# Altium schematic sheet Driver_Modulation.SchDoc: Modulation Driver
size A4; Author: Peter Tanner; SheetNumber: 3; SheetTotal: 9; SPICEModelCacheFEZYSCPS: <root> / <DocumentId>FEZYSCPS</DocumentId> / </root>
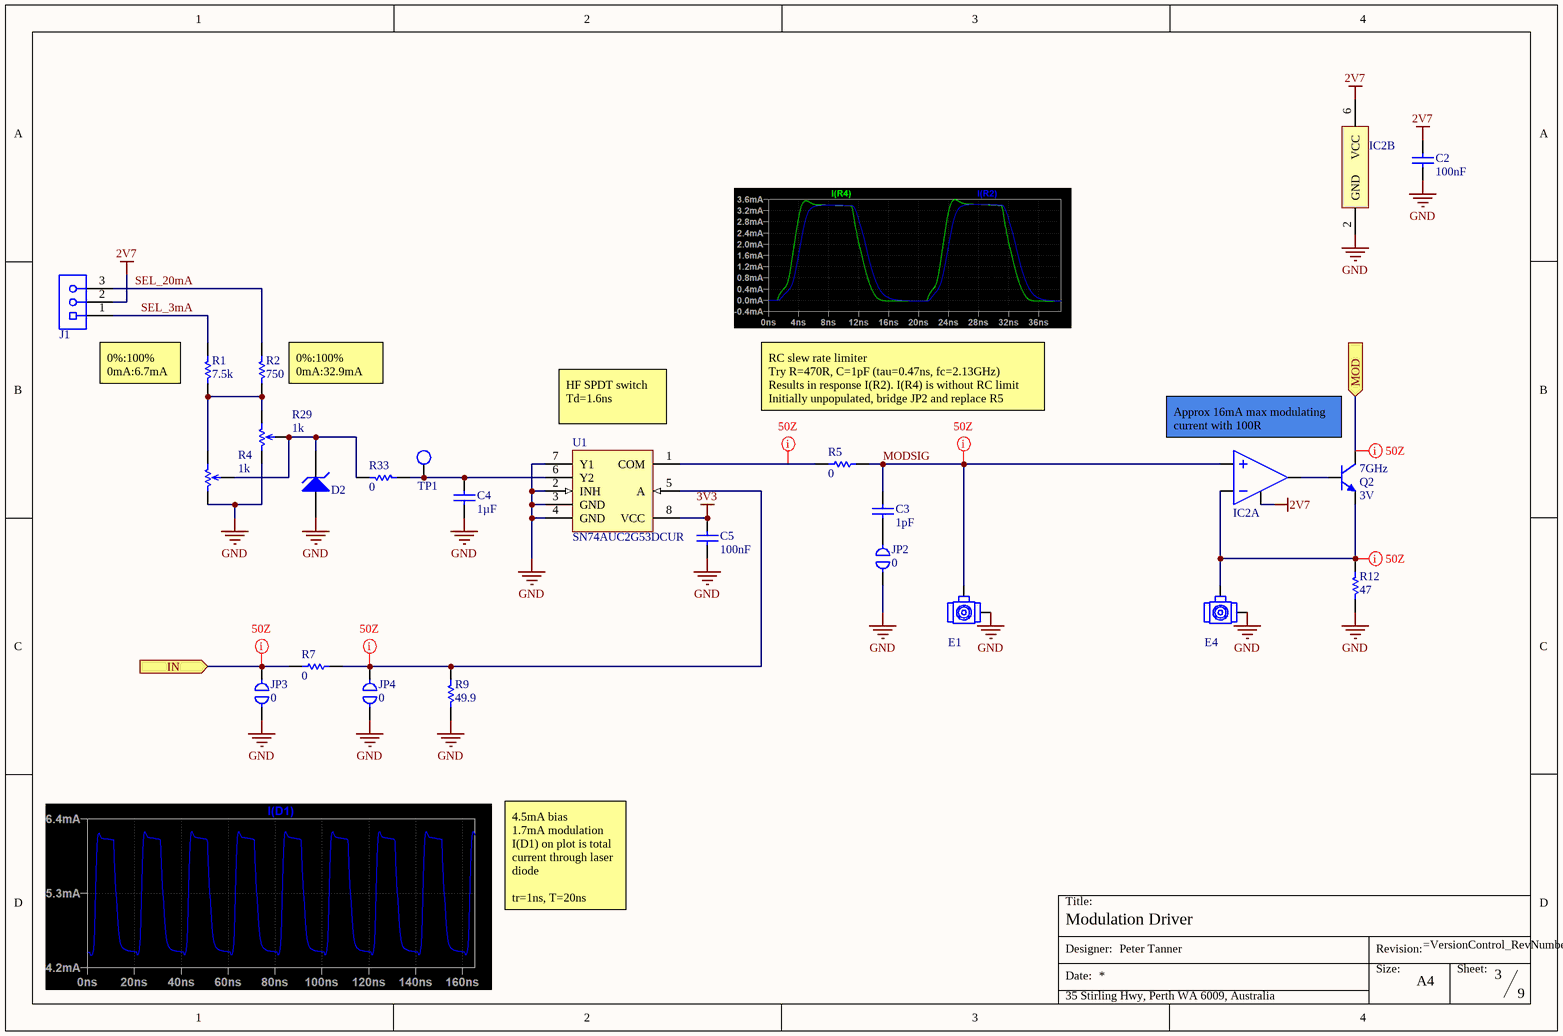
[diagram p0: Driver_Modulation.SchDoc]

## Parts
C2  value 100nF  [CAPC1005X06N]  (hidden comment: CL05B104KB54PNC)
C3  value 1pF  [CAPC1005X06N]  (hidden comment: GCM1555C1H1R0JA16D)
C4  value 1µF  [CAPC1005X06N]  (hidden comment: CL05A105KA5NQNC)
C5  value 100nF  [CAPC1005X06N]  (hidden comment: CL05B104KB54PNC)
D2  H5VU10U  [DFN60P100X45-2L]  (value not drawn)
E1  U.FL-R-SMT-1(01)  [HRS-U.FL-R-SMT-3_V 4_LAYER_KO]  (value not drawn)
E4  U.FL-R-SMT-1(01)  [HRS-U.FL-R-SMT-3_V 4_LAYER_KO]  (value not drawn)
IC2  OPA355NA/3K  [DBV0006A_SOT-23-6_TI__SOT95P280X145-6L]  (value not drawn)  (parts A,B of 2)
J1  10129378-903001BLF  [10129378-903001BLF-Footprint-1]  (value not drawn)
JP2  value 0  [JUMPER-0402-Footprint-1]  (hidden comment: JUMPER-0402)  (no BOM)
JP3  value 0  [RESC1005X04N]  (hidden comment: JUMPER-0402)  (no BOM)
JP4  value 0  [RESC1005X04N]  (hidden comment: JUMPER-0402)  (no BOM)
Q2  Frequency: 7GHz  Emitter Base Voltage (VEBO): 3V  [SOT-23_hongjiacheng__SOT95P240X115-3L]  (hidden comment: 2SC3356)
R1  value 7.5k  [RESC2012X05N]  (hidden comment: 0805W8F7501T5E)
R2  value 750  [RESC2012X05N]  (hidden comment: 0805W8F7500T5E)
R4  value 1k  [BOUR-TC33X-2_V]  (hidden comment: TC33X-2-102E)
R5  value 0  [RESC1005X04N]  (hidden comment: 0402WGF0000TCE)
R7  value 0  [RESC1005X04N]  (hidden comment: 0402WGF0000TCE)
R9  value 49.9  [RESC1005X04N]  (hidden comment: 0402WGF499JTCE)
R12  value 47  [RESC1608X05N]  (hidden comment: RC0603FR-0747RL)
R29  value 1k  [POT_RK0971-L-15KC_N-1]  (hidden comment: RK097_1K)
R33  value 0  [RESC1005X04N]  (hidden comment: 0402WGF0000TCE)
TP1  Test Point 5001  [FP-5001-MFG]  (value not drawn)
U1  SN74AUC2G53DCUR  [DCU0008A_N]

## Ports
IN (in), MOD (in)

## Nets
2V7: C2.2 IC2.5(ENABLE) IC2.6(VCC) J1.2
3V3: C5.2 U1.8(VCC)
GND: C2.1 C4.1 C5.1 D2.2(A) E1.2(GND) E4.2(GND) IC2.2(GND) JP2.1 JP3.1 JP4.1 R4.1(CCW) R9.1 R12.1 R29.1(CCW) U1.2(INH) U1.3(GND) U1.4(GND) U1.7(Y1)
IN: JP3.2 R7.2 ; port IN
MOD: Q2.1(C) ; port MOD
MODSIG: C3.2 E1.1(SIG) IC2.3(VIN+) R5.1
SEL_3mA: J1.1 R1.2
SEL_20mA: J1.3 R2.2
NetC3_1: C3.1 JP2.2
NetC4_2: C4.2 R33.1 TP1.1 U1.6(Y2)
NetD2_1: D2.1(K) R4.2(W) R29.2(W) R33.2
NetE4_1: E4.1(SIG) IC2.4(VIN-) Q2.3(E) R12.2
NetIC2_1: IC2.1(VOUT) Q2.2(B)
NetJP4_2: JP4.2 R7.1 R9.2 U1.5(A)
NetR1_1: R1.1 R2.1 R4.3(CW) R29.3(CW)
NetR5_2: R5.2 U1.1(COM)

## Layout directives
net class 50Z: IN, MOD, MODSIG, NetE4_1, NetJP4_2, NetR5_2

## Notes on the sheet
- 0%:100%
  0mA:6.7mA
- 0%:100%
  0mA:32.9mA
- (near U1) HF SPDT switch
  Td=1.6ns
- RC slew rate limiter
  Try R=470R, C=1pF (tau=0.47ns, fc=2.13GHz)
  Results in response I(R2). I(R4) is without RC limit
  Initially unpopulated, bridge JP2 and replace R5
- Approx 16mA max modulating current with 100R
- 4.5mA bias
  1.7mA modulation
  I(D1) on plot is total current through laser diode
  tr=1ns, T=20ns
- Title:
- Designer:
- Date:
- Size:
- Revision:
- A4
- Sheet:
- 35 Stirling Hwy, Perth WA 6009, Australia

## Library data of the parts
C2 C5 = CMP-00074-10: Ceramic Capacitor, Multilayer, Ceramic, 50V, 10% +Tol, 10% -Tol, X7R, 15% TC, 0.1uF, Surface Mount, 0402; Dielectric: X7R; RoHS Compliant: Yes; Case Code (Imperial): 0402; Tolerance: 10%; JLC_PN: C307331; Voltage Rating: 50V; Source: JLCPCB(Basic)
C3 = CMP-00086-4: Cap Ceramic 1pF 50V C0G 5% Pad SMD 0402 125C Automotive T/R; RoHS Compliant: Unsure; JLC_PN: C1550; Source: JLCPCB(Basic); Tolerance: 5%; Case Code (Imperial): 0402; Voltage Rating: 50V; Dielectric: C0G
C4 = CMP-00190-9: Ceramic Capacitor, Multilayer, Ceramic, 25V, 10% +Tol, 10% -Tol, X5R, 15% TC, 1uF, Surface Mount, 0402; JLC_PN: C52923; RoHS Compliant: Yes; Source: JLCPCB(Basic); Voltage Rating: 25V; Case Code (Imperial): 0402; Dielectric: X5R; Tolerance: 10%
D2 = CMP-00841-4: 5A 55W 16V 9V Unidirectional 5V DFN1006-2L  ESD and Surge Protection (TVS/ESD) ROHS; Capacitance: 0.8pF; Breakdown Voltage: 9V; Source: JLCPCB(Basic); Value: 5V; JLC_PN: C22395519; Polarity: Unidirectional; RoHS Compliant: Unsure; Package: DFN1006-2L; Peak Pulse Power Dissipation: 55W; Clamping Voltage: 16V
E1 E4 = CMP-00380-18: Rf Connectors / Coaxial Connectors SMT Ml Rec Au 50 Ohm W/anti Sldr Wicking UFL; Number of Ports: 1; Dielectric Material: Polymer; Impedance: 50; Mating Cycles: 30; Connector Type: Receptacle,Male Pin; Body Plating: Silver; Center Contact Plating: Gold; Max Frequency: 6GHz; Body Material: Bronze; Lead Free: Lead Free; Series: U.FL; JLC PN: C88374; Contact Material: Brass; Fastening Type: SNAP-ON; Min Operating Temperature: -40°C; RoHS Compliant: Yes; Housing Color: Beige; Depth: 3mm; Contact Plating: Gold; Mount: Surface Mount; Length: 3.1mm; Orientation: Vertical; Termination: Solder; Max Operating Temperature: 90°C; Source: UWAA_Stock
IC2 = CMP-00897-1: Operational Amplifier, 1 Func, 9000uV Offset-Max, 100MHz Band Width, CMOS, PDSO6; Gain Bandwidth Product: 200MHz; Output Current per Channel: 60mA; Operating Supply Current: 11mA; Max Supply Voltage: 5.5V; Input Bias Current: 50pA; Input Offset Voltage (Vos): 9mV; Slew Rate: 300V/µs; Power Supply Rejection Ratio (PSRR): 88dB; Min Supply Voltage: 2.7V; Number of Channels: 1; Voltage Gain: 10000; Common Mode Rejection Ratio: 80dB; Source: JLCPCB(Extended,Economic_PCBA); RoHS Compliant: Yes; Quiescent Current: 11mA; Case/Package: SOT-23-6; JLC_PN: C2058090
J1 = CMP-00188-3: Conn Unshrouded Header HDR 3 POS 2.54mm Solder ST Thru-Hole Poly Bag; RoHS Compliant: Unsure; Source: Aliexpress
JP2-JP4 = CMP-009-00001-6: 0402 pad placeholder for 0-ohm resistor jumper; Tolerance: 1%; RoHS Compliant: Unsure; Source: Distributor; Case Code (Imperial): 0402
Q2 = CMP-00894-2: RF Small Signal Bipolar Transistor, 0.1A I(C), 1-Element, Ultra High Frequency Band, Silicon, NPN; pin to pad: 1>3 2>1 3>2; Max Collector Current: 100mA; DC Current Gain-Min (hFE): 50; Max Power Dissipation: 200mW; Collector-emitter Voltage Max: 12V; Collector Base Voltage (VCBO): 20V; Source: JLCPCB(Basic); Polarity: NPN; Case/Package: SOT-23; RoHS Compliant: Yes; JLC_PN: C28646266
R1 = CMP-077-000027-1: -55℃~+155℃ 125mW 150V 7.5kΩ Thick Film Resistor ±1% ±100ppm/℃ 0805 Chip Resistor - Surface Mount ROHS; Case Code (Imperial): 0805; Source: JLCPCB(Basic); Voltage Rating: 150V; Temperature Coefficient: ±100ppm/℃; JLC_PN: C17807; Tolerance: 1%; RoHS Compliant: Yes; Power Rating: 125mW
R2 = CMP-077-000036-1: Thick Film Resistors - SMD RMC 0805 1/8W 1% T/R-5000; Voltage Rating: 150V; Temperature Coefficient: ±100ppm/℃; Power Rating: 125mW; Case Code (Imperial): 0402; JLC_PN: C17818; Tolerance: 1%; Source: JLCPCB(Basic); RoHS Compliant: Unsure
R4 = CMP-077-000035-1: SMD 3mm Cermet Trimmer - Leadfree 3MM 1KOHMS 25% 0.1WATT OPEN FRM; Power Rating: 100mW; Temperature Coefficient: 250ppm/°C; Source: JLCPCB(Basic); RoHS Compliant: Unsure; Case Code (Imperial): 0402; Tolerance: 25%
R5 R7 R33 = CMP-00817-3: Metal Glaze/thick Film, 0.0625W, 0ohm, 0402; Tolerance: 1%; JLC_PN: C17168; RoHS Compliant: Unsure; Case Code (Imperial): 0402; Source: JLCPCB(Basic)
R9 = CMP-077-000018-1: 62.5mW Thick Film Resistors 50V ±100ppm/℃ ±1% 49.9Ω 0402 Chip Resistor - Surface Mount ROHS; Temperature Coefficient: 200ppm/°C; Power Rating: 62.5mW; Tolerance: 1%; Source: JLCPCB(Basic); RoHS Compliant: Yes; JLC_PN: C25120; Case Code (Imperial): 0402
R12 = CMP-00601-4: Res Thick Film 0603 47 Ohm 1% 0.1W(1/10W) ±100ppm/C Pad SMD T/R; Temperature Coefficient: 100ppm/°C; Voltage Rating: 75V; Power Rating: 100mW; RoHS Compliant: Unsure; JLC_PN: C23182; Tolerance: 1%; Source: JLCPCB(Basic); Case Code (Imperial): 0603
R29 = CMP-077-000037-1: Potentiometer, 0.05W, 1000ohm, 10V, 20% +/-Tol, 1 Turn(s); Power Rating: 50mW; RoHS Compliant: Unsure; Tolerance: 20%; Source: Aliexpress; Voltage Rating: 10V; Case Code (Imperial): N/A
TP1 = CMP-001-0013-1: MS27478 - Connectors Receptacle Electrical Solder Mounting Solder Type Hermetic Seal 38999 Series II Test Point; Voltage Rating: 0V; Current Rating: 0A; Number of Contacts: 1; Contact Material: Silver; RoHS Compliant: Unsure; Housing Color: Black; Height: 4.72mm; Length: 7.62mm; Orientation: Straight; Termination: Through Hole; Gender: -; Mounting Technology: Through Hole; Number of Rows: 1; Source: UWAA_Stock; Contact Plating: Tin
U1 = CMP-071-000018-2: 2.5-V, 2: 1 (SPDT), 1-channel general-purpose analog switch 8-VSSOP -40 to 85; Number of Inputs: 2; Turn-Off Delay Time: 10ns; Max Supply Voltage: 2.7V; Bandwidth: 198MHz; Value: 15Ω; Number of Circuits: 1; Min Supply Voltage: 800mV; Supply Type: Single; Low Level Output Current: 50mA; Turn-On Delay Time: 9.2ns; Operating Supply Current: 10µA; Propagation Delay: 100ps; Mount: Surface Mount; Number of Pins: 8; Radiation Hardening: No; RoHS: Compliant; Source: Distributor; Case/Package: VSSOP; Throw Configuration: SPDT; Number of Bits: 2; Length: 2.3mm; Height: 900µm; Thickness: 850µm; Number of Channels: 2; High Level Output Current: 50mA; Max Supply Current: 10µA